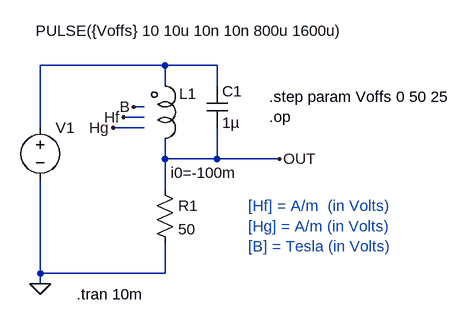
[diagram p0: schematic Draft4.asc]
Draft4.asc, the LTspice schematic file:
Version 4
SHEET 1 880 680
WIRE 144 16 -48 16
WIRE 224 16 144 16
WIRE 144 48 144 16
WIRE 224 48 224 16
WIRE 112 80 96 80
WIRE 112 96 80 96
WIRE -48 112 -48 16
WIRE 112 112 64 112
WIRE 144 160 144 128
WIRE 224 160 224 112
WIRE 224 160 144 160
WIRE 320 160 224 160
WIRE 144 208 144 160
WIRE -48 336 -48 192
WIRE 144 336 144 288
WIRE 144 336 -48 336
WIRE -48 352 -48 336
FLAG -48 352 0
FLAG 320 160 OUT
FLAG 96 80 B
FLAG 80 96 Hf
FLAG 64 112 Hg
SYMBOL res 128 192 R0
SYMATTR InstName R1
SYMATTR Value 50
SYMBOL voltage -48 96 R0
WINDOW 3 -7 -133 Left 0
WINDOW 123 24 44 Left 0
WINDOW 39 0 0 Left 0
SYMATTR Value PULSE({Voffs} 10 10u 10n 10n 800u 1600u)
SYMATTR InstName V1
SYMBOL cap 208 48 R0
SYMATTR InstName C1
SYMATTR Value 1µ
SYMBOL Custom\\Transformer\\Lbeh 144 96 R0
WINDOW 39 9 85 Left 0
SYMATTR InstName L1
SYMATTR SpiceLine i0=-100m
TEXT 8 368 Left 0 !.tran 10m
TEXT 272 232 Left 0 ;[Hf] = A/m  (in Volts)\n[Hg] = A/m (in Volts)\n[B] = Tesla (in Volts)
TEXT 304 64 Left 0 !.step param Voffs 0 50 25\n.op

The netlist it stands for:
* Draft4.asc
R1 OUT 0 50
V1 N001 0 PULSE({Voffs} 10 10u 10n 10n 800u 1600u)
C1 N001 OUT 1µ
XL1 N001 OUT B Hf Hg Lmod Hc=16 Bs=0.44 Br=0.1 N=1000 A=0.0000251 s1=0.0006858 s2=0.0198 i0=-100m Rs=1f Rp=10Meg Cp=1f  ; pins P1 P2 B Hf Hg
.tran 10m
* [Hf] = A/m  (in Volts)
* [Hg] = A/m (in Volts)
* [B] = Tesla (in Volts)
.step param Voffs 0 50 25
.op
.lib Lbeh.sub
.backanno
.end